# Altium schematic sheet cell_fuses.SchDoc: foxBMS BMS-Slave 12-Cell
size A3; DocumentNumber: 4; SheetNumber: 4; SheetTotal: 19; AUTHOR: Fraunhofer IISB foxBMS Team; SheetDescription: Cell Voltage Sense Fuses
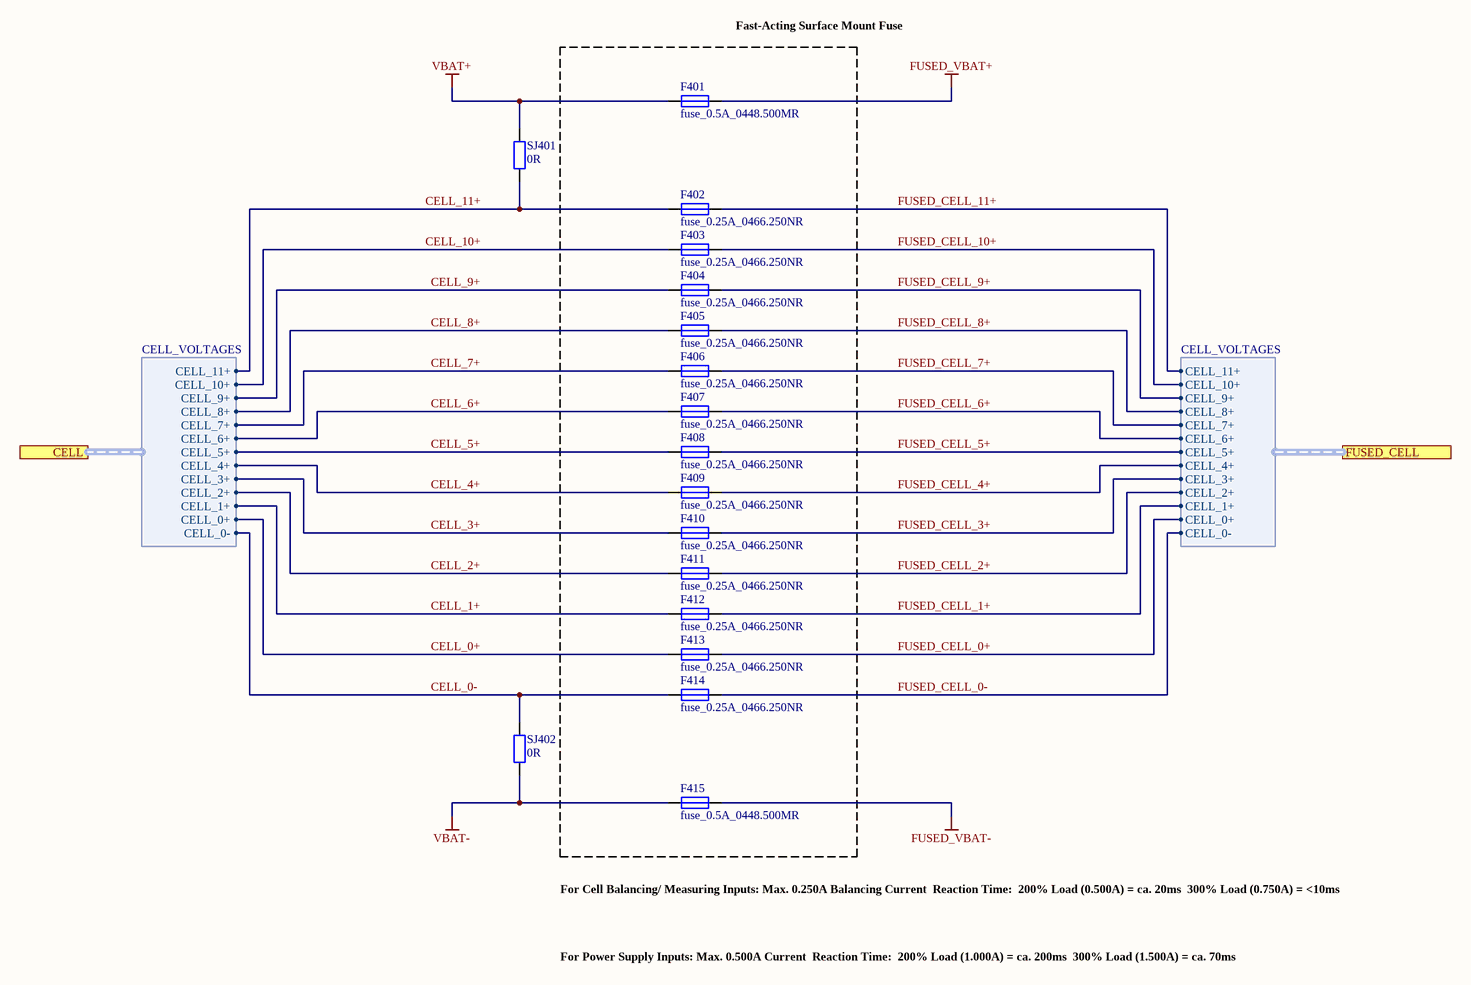
[diagram p0: cell_fuses.SchDoc]

## Parts
F401  fuse_0.5A_0448.500MR  [LITTLEFUSE_448]
F402  fuse_0.25A_0466.250NR  [LITTLEFUSE_466]
F403  fuse_0.25A_0466.250NR  [LITTLEFUSE_466]
F404  fuse_0.25A_0466.250NR  [LITTLEFUSE_466]
F405  fuse_0.25A_0466.250NR  [LITTLEFUSE_466]
F406  fuse_0.25A_0466.250NR  [LITTLEFUSE_466]
F407  fuse_0.25A_0466.250NR  [LITTLEFUSE_466]
F408  fuse_0.25A_0466.250NR  [LITTLEFUSE_466]
F409  fuse_0.25A_0466.250NR  [LITTLEFUSE_466]
F410  fuse_0.25A_0466.250NR  [LITTLEFUSE_466]
F411  fuse_0.25A_0466.250NR  [LITTLEFUSE_466]
F412  fuse_0.25A_0466.250NR  [LITTLEFUSE_466]
F413  fuse_0.25A_0466.250NR  [LITTLEFUSE_466]
F414  fuse_0.25A_0466.250NR  [LITTLEFUSE_466]
F415  fuse_0.5A_0448.500MR  [LITTLEFUSE_448]
SJ401  0R  [RESC1608X05N]
SJ402  0R  [RESC1608X05N]

## Blocks framed on the sheet
Fast-Acting Surface Mount Fuse: F401-F415

## Ports
CELL (harness CELL_VOLTAGES), FUSED_CELL (harness CELL_VOLTAGES)

## Harnesses
CELL_VOLTAGES: CELL_0-, CELL_0+, CELL_1+, CELL_10+, CELL_11+, CELL_2+, CELL_3+, CELL_4+, CELL_5+, CELL_6+, CELL_7+, CELL_8+, CELL_9+

## Nets
FUSED_VBAT+: F401.2
FUSED_VBAT-: F415.2
VBAT+: F401.1 SJ401.1
VBAT-: F415.1 SJ402.2
CELL_0+: F413.1 ; port CELL.CELL_0+
CELL_0-: F414.1 SJ402.1 ; port CELL.CELL_0-
CELL_1+: F412.1 ; port CELL.CELL_1+
CELL_2+: F411.1 ; port CELL.CELL_2+
CELL_3+: F410.1 ; port CELL.CELL_3+
CELL_4+: F409.1 ; port CELL.CELL_4+
CELL_5+: F408.1 ; port CELL.CELL_5+
CELL_6+: F407.1 ; port CELL.CELL_6+
CELL_7+: F406.1 ; port CELL.CELL_7+
CELL_8+: F405.1 ; port CELL.CELL_8+
CELL_9+: F404.1 ; port CELL.CELL_9+
CELL_10+: F403.1 ; port CELL.CELL_10+
CELL_11+: F402.1 SJ401.2 ; port CELL.CELL_11+
FUSED_CELL_0+: F413.2 ; port FUSED_CELL.CELL_0+
FUSED_CELL_0-: F414.2 ; port FUSED_CELL.CELL_0-
FUSED_CELL_1+: F412.2 ; port FUSED_CELL.CELL_1+
FUSED_CELL_2+: F411.2 ; port FUSED_CELL.CELL_2+
FUSED_CELL_3+: F410.2 ; port FUSED_CELL.CELL_3+
FUSED_CELL_4+: F409.2 ; port FUSED_CELL.CELL_4+
FUSED_CELL_5+: F408.2 ; port FUSED_CELL.CELL_5+
FUSED_CELL_6+: F407.2 ; port FUSED_CELL.CELL_6+
FUSED_CELL_7+: F406.2 ; port FUSED_CELL.CELL_7+
FUSED_CELL_8+: F405.2 ; port FUSED_CELL.CELL_8+
FUSED_CELL_9+: F404.2 ; port FUSED_CELL.CELL_9+
FUSED_CELL_10+: F403.2 ; port FUSED_CELL.CELL_10+
FUSED_CELL_11+: F402.2 ; port FUSED_CELL.CELL_11+

## Notes on the sheet
- For Cell Balancing/ Measuring Inputs: Max. 0.250A Balancing Current
  Reaction Time:
  200% Load (0.500A) = ca. 20ms
  300% Load (0.750A) = <10ms
- For Power Supply Inputs: Max. 0.500A Current
  Reaction Time:
  200% Load (1.000A) = ca. 200ms
  300% Load (1.500A) = ca. 70ms
- Fraunhofer IISB
- Schottkystr. 10
- developed by:
- 91058 Erlangen
- Germany
- Author
- Project
- License
- Description
- File
- Version
- Release Date
- Sheet
- www.foxbms.org
- www.iisb.fraunhofer.de
- foxBMS Team
- /

## Library data of the parts
F401 F415 = fuse_0.5A_0448.500MR: Fuse, Surface Mount, NANO2 Series, 500 mA, 125 VAC, 32 VDC, Very Fast Acting, SMD; Manufacturer: Littlefuse; Automotive Qualified: False; Part Number: fuse_0.5A_0448.500MR; Operating Temperature: -55°C - +125°C; ComponentLink1Description: Datasheet; ComponentLink1URL: http://www.farnell.com/datasheets/1792947.pdf; Supplier 1: Farnell; Supplier Part Number 1: 1596919
F402-F414 = fuse_0.25A_0466.250NR: Fuse, Surface Mount, 466 Series, 250 mA, 125 VAC, 125 VDC, Very Fast Acting, 1206; Manufacturer: Littlefuse; Automotive Qualified: False; Part Number: fuse_0.25A_0466.250NR; Operating Temperature: -55°C - +90°C; ComponentLink1Description: Datasheet; ComponentLink1URL: http://www.farnell.com/datasheets/1796765.pdf; Supplier 1: Farnell; Supplier Part Number 1: 9921826
SJ401 SJ402 = gen_R_0R_0603: SMD Resistor 0R 0603; Power: 0.1W; Case EIA: 0603; Case Metric: 1608; Maximum Working Voltage: 75V; PnP Package: R_0603; Automotive Qualified: False; Part Number: gen_R_0R_0603; Operating Temperature: -55°C - +155°C; Resistance: 0R; Series: Jumper; PnP Value: 0R; Supplier 1: Farnell; Supplier Part Number 1: 2073345